# Altium schematic sheet pwm-drv.SchDoc
size B
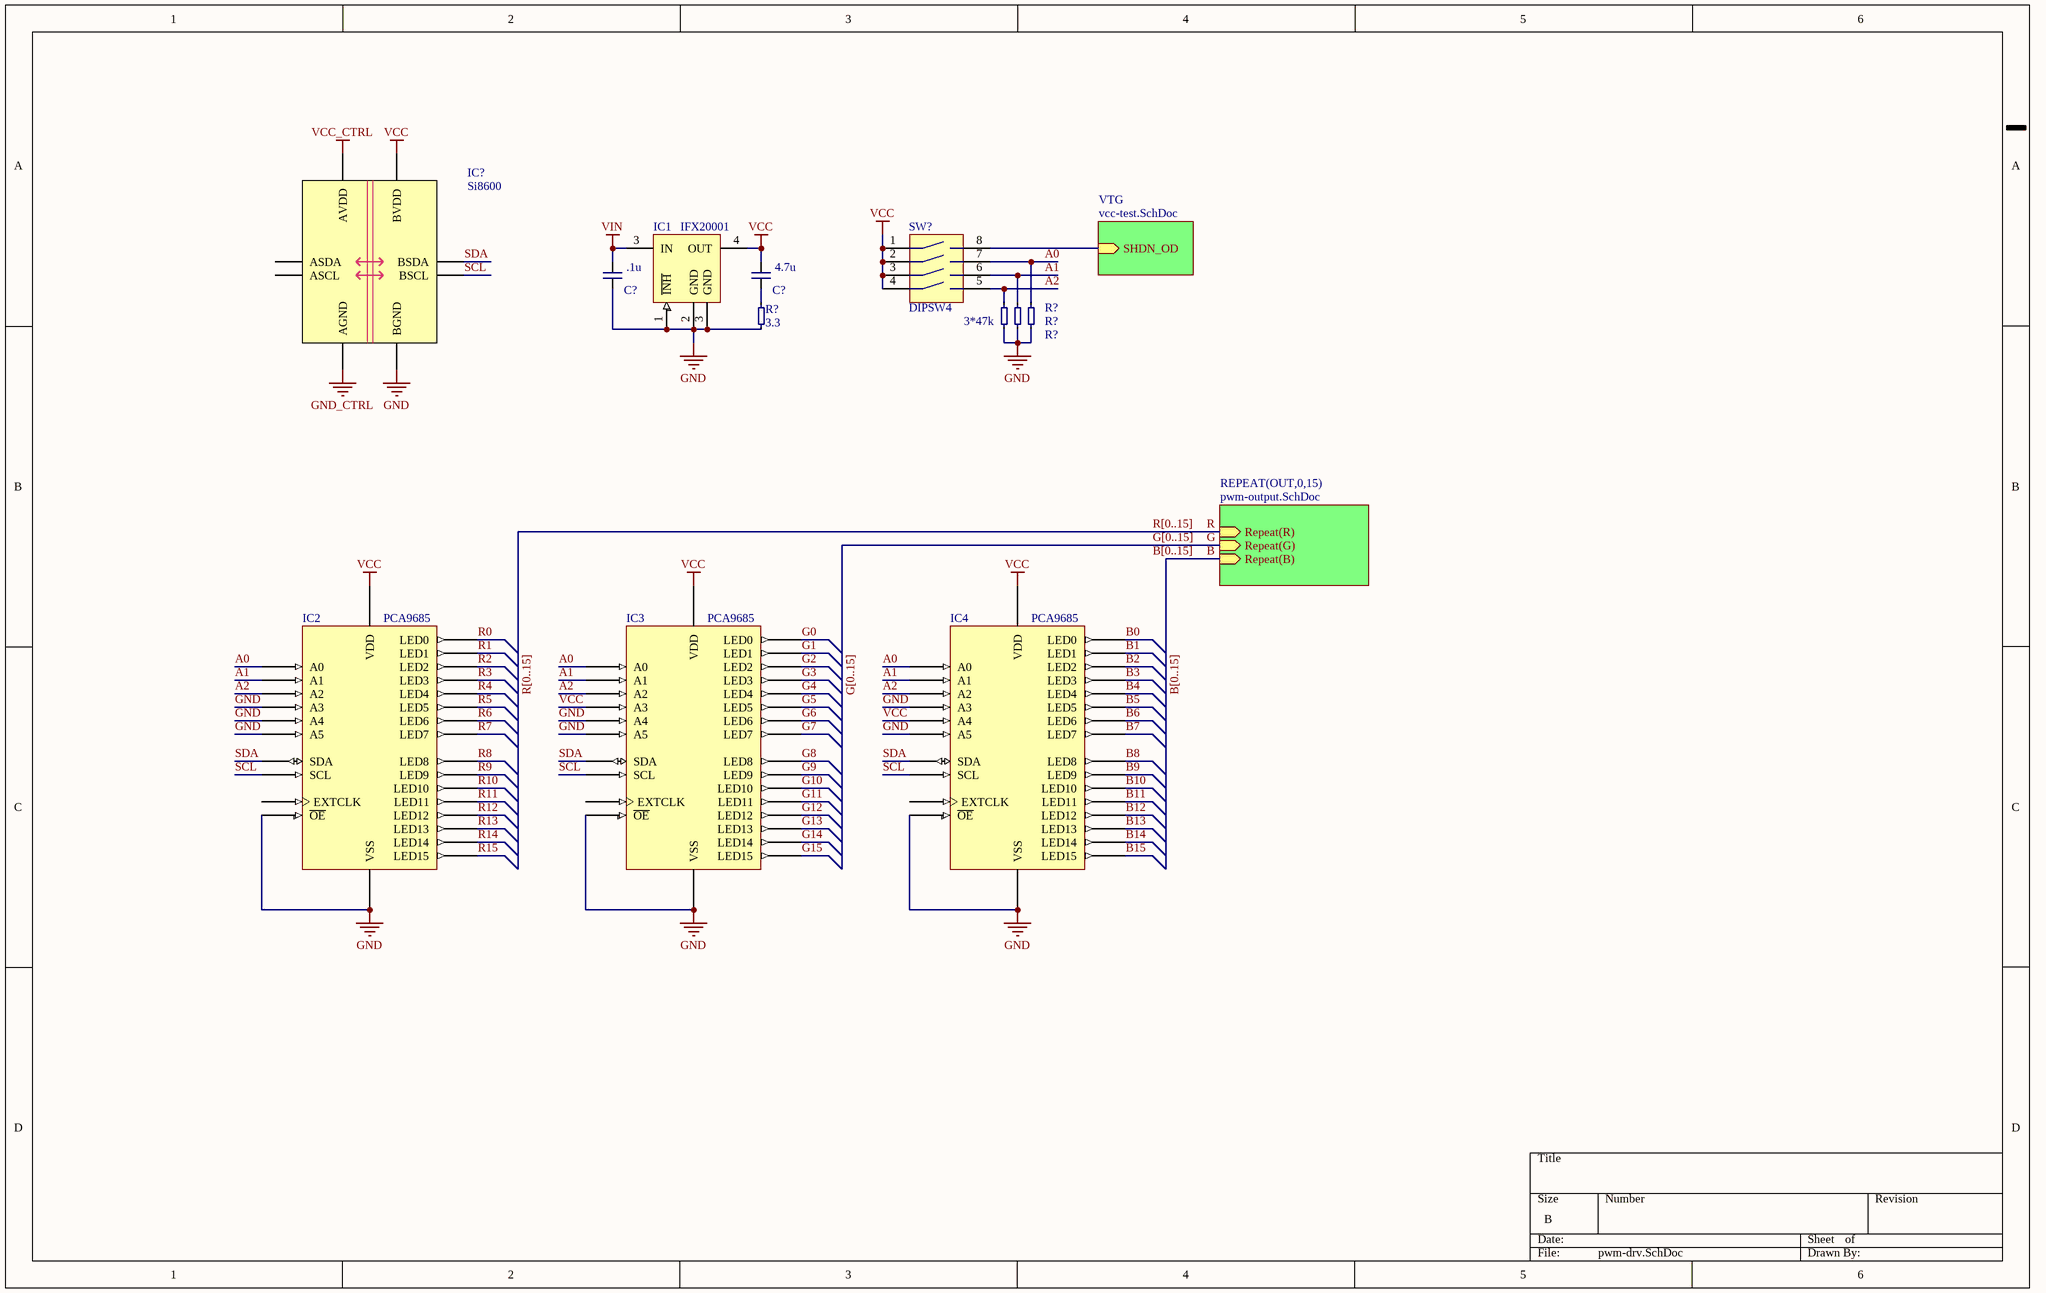
[diagram p0: pwm-drv.SchDoc]

## Parts
(Parts that share a designator on the sheet are numbered #1, #2 ... from top to bottom, then left to right.)
C?#1  .1u
C?#2  4.7u
IC1  IFX20001  [PG-SCT595-5]
IC2  PCA9685  [TSSOP28]
IC3  PCA9685  [TSSOP28]
IC4  PCA9685  [TSSOP28]
IC?  Si8600  [SO-8]
R?#1  3.3
R?#2  47k  (value not drawn)
R?#3  47k  (value not drawn)
R?#4  47k  (value not drawn)
SW?  DIPSW4  [DIPSW4]

## Sub-sheets
REPEAT(OUT,0,15) = pwm-output.SchDoc: Repeat(R) (in), Repeat(G) (in), Repeat(B) (in)
VTG = vcc-test.SchDoc: SHDN_OD (in)

## Nets
GND: C?#1.2 IC1.1(~{INH}) IC1.2(GND) IC1.3(GND) IC2.4(A3) IC2.5(A4) IC2.14(VSS) IC2.23(~{OE}) IC2.24(A5) IC3.5(A4) IC3.14(VSS) IC3.23(~{OE}) IC3.24(A5) IC4.4(A3) IC4.14(VSS) IC4.23(~{OE}) IC4.24(A5) IC?.5(BGND) R?#1.2 R?#2.2 R?#3.2 R?#4.2
GND_CTRL: IC?.4(AGND)
VCC: C?#2.1 IC1.4(OUT) IC2.28(VDD) IC3.4(A3) IC3.28(VDD) IC4.5(A4) IC4.28(VDD) IC?.8(BVDD) SW?.1 SW?.2 SW?.3 SW?.4
VCC_CTRL: IC?.1(AVDD)
VIN: C?#1.1 IC1.3(IN)
A0: IC2.1(A0) IC3.1(A0) IC4.1(A0) R?#4.1 SW?.7
A1: IC2.2(A1) IC3.2(A1) IC4.2(A1) R?#3.1 SW?.6
A2: IC2.3(A2) IC3.3(A2) IC4.3(A2) R?#2.1 SW?.5
B: sheet REPEAT(OUT,0,15)/Repeat(B)
B0: IC4.6(LED0)
B1: IC4.7(LED1)
B2: IC4.8(LED2)
B3: IC4.9(LED3)
B4: IC4.10(LED4)
B5: IC4.11(LED5)
B6: IC4.12(LED6)
B7: IC4.13(LED7)
B8: IC4.15(LED8)
B9: IC4.16(LED9)
B10: IC4.17(LED10)
B11: IC4.18(LED11)
B12: IC4.19(LED12)
B13: IC4.20(LED13)
B14: IC4.21(LED14)
B15: IC4.22(LED15)
G: sheet REPEAT(OUT,0,15)/Repeat(G)
G0: IC3.6(LED0)
G1: IC3.7(LED1)
G2: IC3.8(LED2)
G3: IC3.9(LED3)
G4: IC3.10(LED4)
G5: IC3.11(LED5)
G6: IC3.12(LED6)
G7: IC3.13(LED7)
G8: IC3.15(LED8)
G9: IC3.16(LED9)
G10: IC3.17(LED10)
G11: IC3.18(LED11)
G12: IC3.19(LED12)
G13: IC3.20(LED13)
G14: IC3.21(LED14)
G15: IC3.22(LED15)
R: sheet REPEAT(OUT,0,15)/Repeat(R)
R0: IC2.6(LED0)
R1: IC2.7(LED1)
R2: IC2.8(LED2)
R3: IC2.9(LED3)
R4: IC2.10(LED4)
R5: IC2.11(LED5)
R6: IC2.12(LED6)
R7: IC2.13(LED7)
R8: IC2.15(LED8)
R9: IC2.16(LED9)
R10: IC2.17(LED10)
R11: IC2.18(LED11)
R12: IC2.19(LED12)
R13: IC2.20(LED13)
R14: IC2.21(LED14)
R15: IC2.22(LED15)
SCL: IC2.26(SCL) IC3.26(SCL) IC4.26(SCL) IC?.6(BSCL)
SDA: IC2.27(SDA) IC3.27(SDA) IC4.27(SDA) IC?.7(BSDA)
NetC?#2_2: C?#2.2 R?#1.1
NetSW?_8: SW?.8 ; sheet VTG/SHDN_OD

Not connected (* = marked no-connect by the designer): IC2 25(EXTCLK); IC3 25(EXTCLK); IC4 25(EXTCLK); IC? 2(ASDA) 3(ASCL)

## Buses and harness runs
bus B[0..15]
bus G[0..15]
bus R[0..15]

## Notes on the sheet
- (near R?#2) 3*47k
- Labels drawn without touching a wire or pin: B[0..15]

## Library data of the parts
C?#1 C?#2 = Cap
IC1 = IFX20001: LDO 40V 30mA
IC2-IC4 = PCA9685: 16ch 12-bit I2C PWM Controller
IC? = Si8600: Bidirectional I2C Isolator
R?#1-R?#4 = Res
SW? = DIPSW4: DIP-switch 4 pole